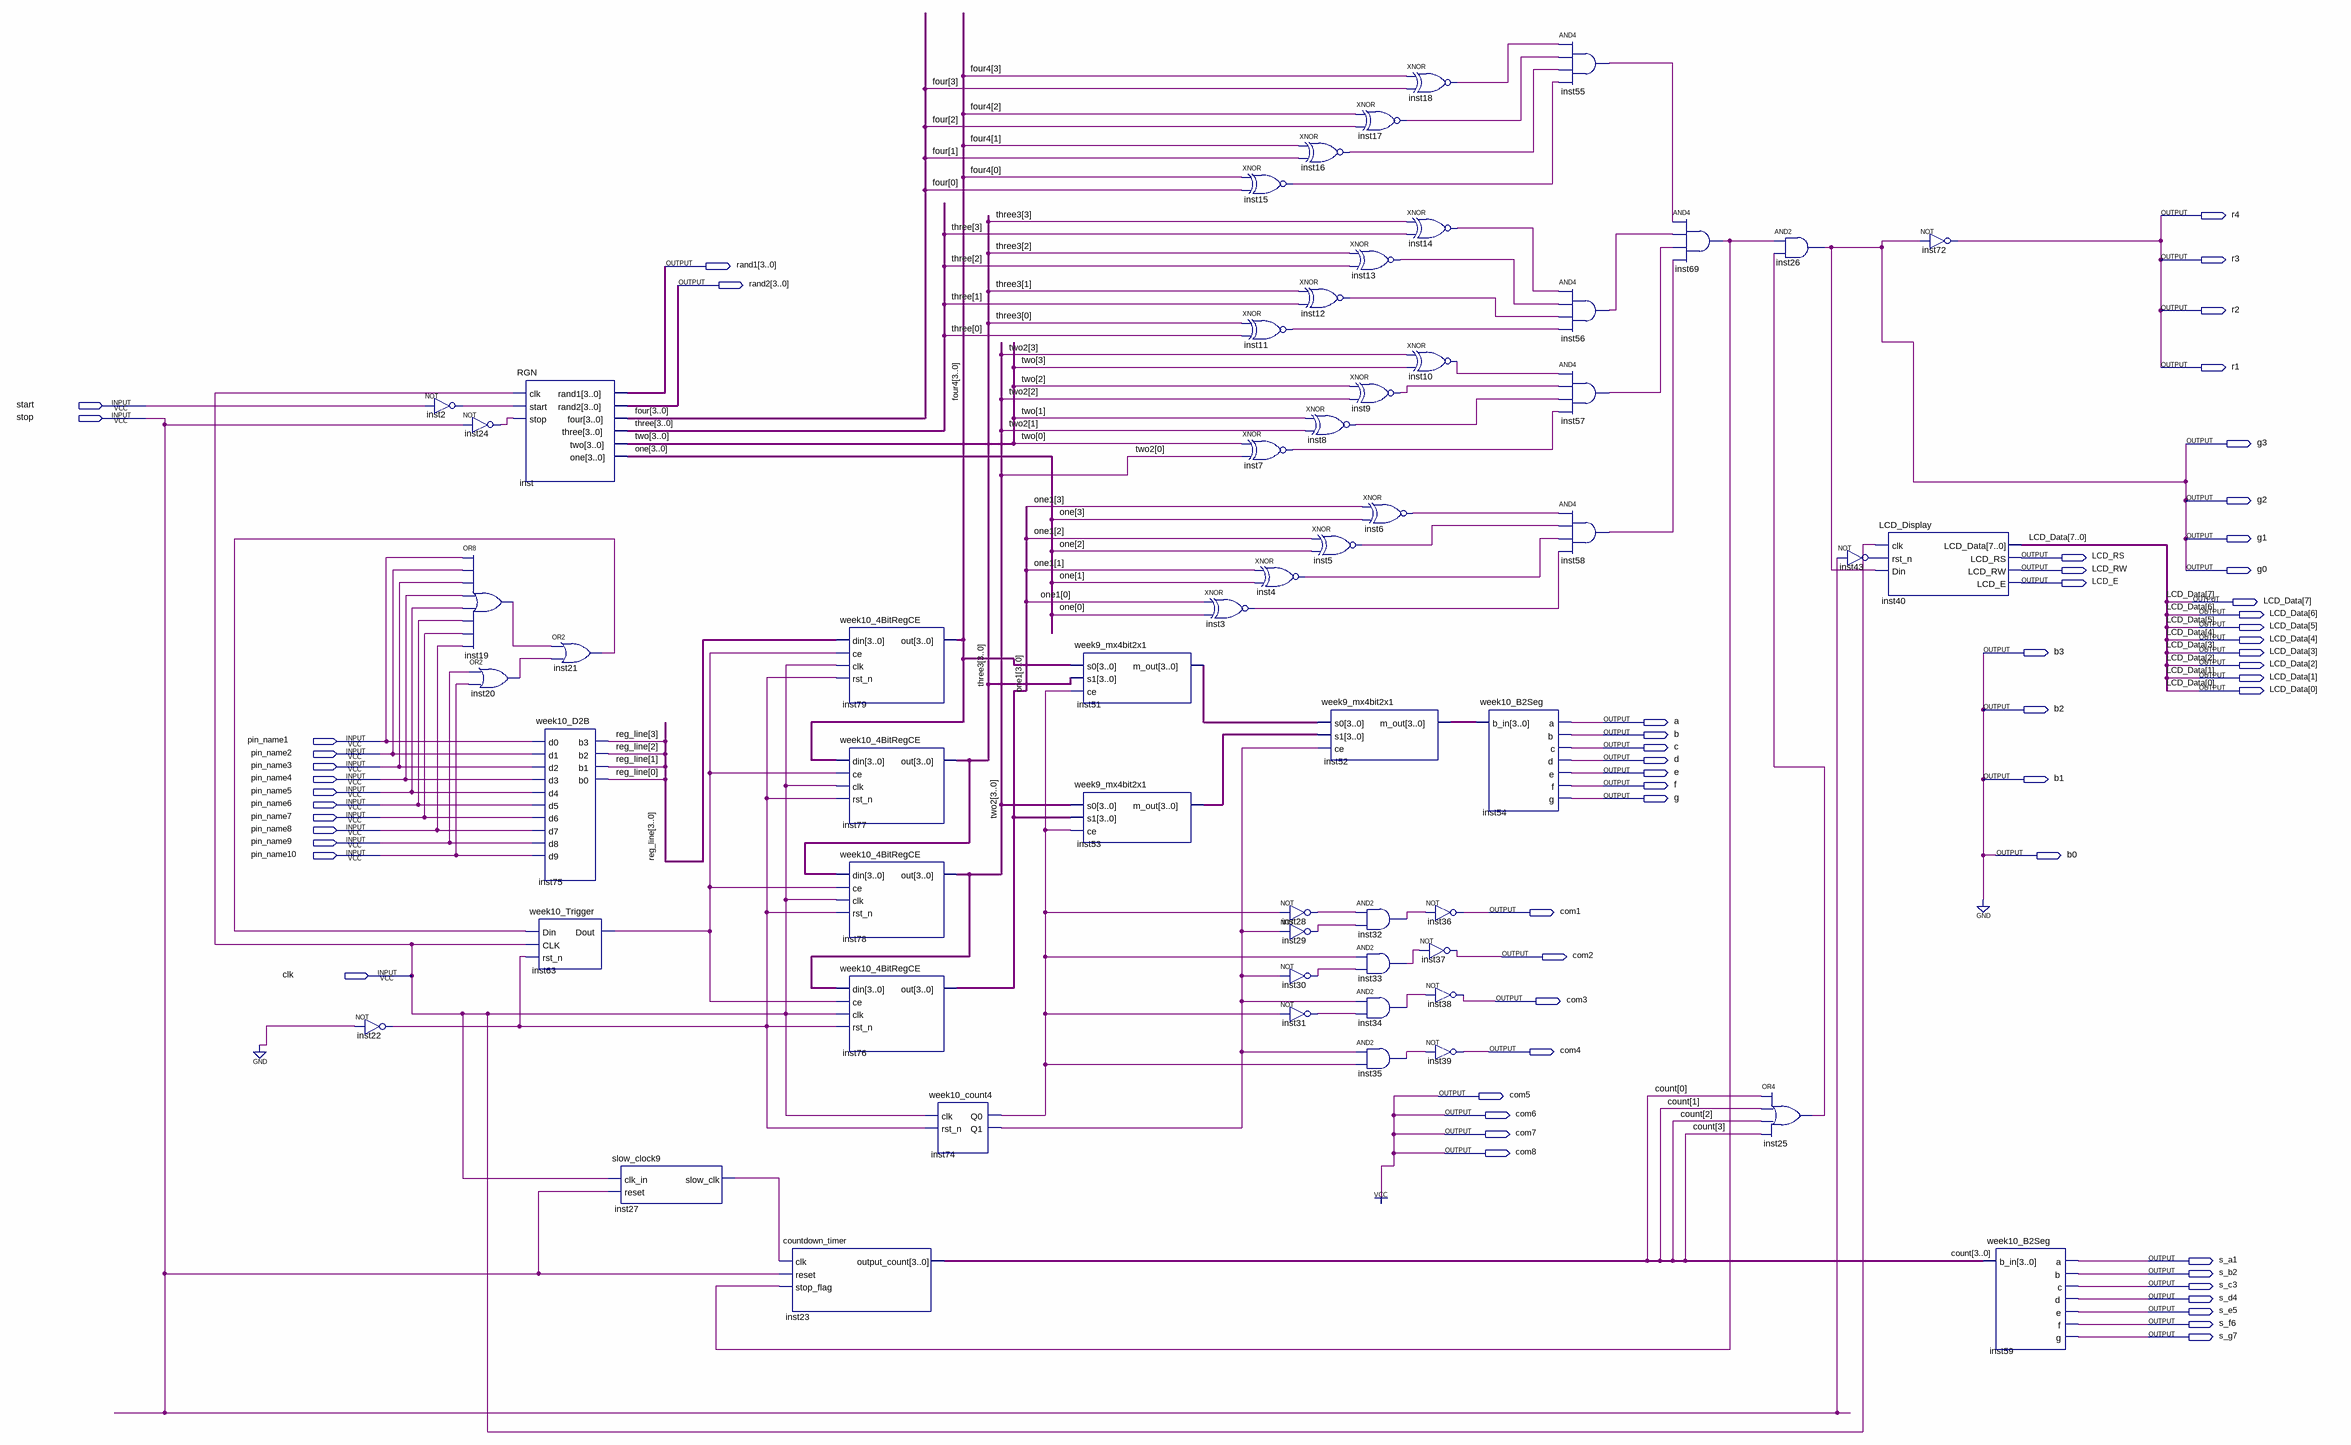
[diagram p0: schematic sheet]
// Quartus schematic FinalModule.bdf as structural Verilog: 59 symbols, 60 pins
module FinalModule (
  input  start,
  input  stop,
  input  pin_name1,
  input  pin_name2,
  input  pin_name3,
  input  pin_name4,
  input  pin_name5,
  input  pin_name6,
  input  pin_name7,
  input  pin_name8,
  input  pin_name9,
  input  pin_name10,
  input  clk,
  output r4,
  output r3,
  output [3:0] rand1,
  output [3:0] rand2,
  output r2,
  output r1,
  output g3,
  output g2,
  output g1,
  output LCD_RS,
  output LCD_RW,
  output g0,
  output LCD_E,
  output [7:0] LCD_Data,
  output b3,
  output b2,
  output a,
  output b,
  output c,
  output d,
  output e,
  output b1,
  output f,
  output g,
  output b0,
  output com1,
  output com2,
  output com3,
  output com4,
  output com5,
  output com6,
  output com7,
  output com8,
  output s_a1,
  output s_b2,
  output s_c3,
  output s_d4,
  output s_e5,
  output s_f6,
  output s_g7
);

  wire inst2_out, inst3_out, inst4_out, inst5_out, inst6_out, inst7_out, inst8_out, inst9_out, inst10_out,
       inst11_out, inst12_out, inst13_out, inst14_out, inst15_out, inst16_out, inst17_out, inst18_out,
       inst19_out, inst20_out, inst21_out, inst22_out, inst24_out, inst25_out, inst27_slow_clk, inst28_out,
       inst29_out, inst30_out, inst31_out, inst32_out, inst33_out, inst34_out, inst35_out, inst43_out,
       inst55_out, inst56_out, inst57_out, inst58_out, inst63_dout, inst69_out, inst74_q0, inst74_q1;
  wire [3:0] count, four, four4, inst51_m_out, inst52_m_out, inst53_m_out, one, one1, reg_line, three,
       three3, two, two2;

  not inst22 (inst22_out, 1'b0);
  not inst2 (inst2_out, start);
  not inst24 (inst24_out, stop);
  or inst19 (inst19_out, pin_name1, pin_name2, pin_name3, pin_name4, pin_name5, pin_name6, pin_name7, pin_name8);
  or inst20 (inst20_out, pin_name9, pin_name10);
  RGN inst (
    .clk(clk), .start(inst2_out), .stop(inst24_out), .rand1(rand1), .rand2(rand2), .four(four),
    .three(three), .two(two), .one(one));
  week10_D2B inst75 (
    .d0(pin_name1), .d1(pin_name2), .d2(pin_name3), .d3(pin_name4), .d4(pin_name5), .d5(pin_name6),
    .d6(pin_name7), .d7(pin_name8), .d8(pin_name9), .d9(pin_name10), .b3(reg_line[3]), .b2(reg_line[2]),
    .b1(reg_line[1]), .b0(reg_line[0]));
  week10_Trigger inst63 (.Din(inst21_out), .CLK(clk), .rst_n(inst22_out), .Dout(inst63_dout));
  or inst21 (inst21_out, inst19_out, inst20_out);
  slow_clock9 inst27 (.clk_in(clk), .reset(stop), .slow_clk(inst27_slow_clk));
  countdown_timer inst23 (.clk(inst27_slow_clk), .reset(stop), .stop_flag(inst69_out), .output_count(count));
  week10_4BitRegCE inst79 (.din(reg_line), .ce(inst63_dout), .clk(clk), .rst_n(inst22_out), .out(four4));
  week10_4BitRegCE inst77 (.din(four4), .ce(inst63_dout), .clk(clk), .rst_n(inst22_out), .out(three3));
  week10_4BitRegCE inst78 (.din(three3), .ce(inst63_dout), .clk(clk), .rst_n(inst22_out), .out(two2));
  week10_4BitRegCE inst76 (.din(two2), .ce(inst63_dout), .clk(clk), .rst_n(inst22_out), .out(one1));
  week10_count4 inst74 (.clk(clk), .rst_n(inst22_out), .Q0(inst74_q0), .Q1(inst74_q1));
  week9_mx4bit2x1 inst51 (.s0(four4), .s1(three3), .ce(inst74_q0), .m_out(inst51_m_out));
  week9_mx4bit2x1 inst53 (.s0(two2), .s1(one1), .ce(inst74_q0), .m_out(inst53_m_out));
  xnor inst15 (inst15_out, four4[0], four[0]);
  xnor inst11 (inst11_out, three3[0], three[0]);
  xnor inst7 (inst7_out, two[0], two2[0]);
  xnor inst3 (inst3_out, one1[0], one[0]);
  xnor inst4 (inst4_out, one1[1], one[1]);
  not inst28 (inst28_out, inst74_q0);
  not inst29 (inst29_out, inst74_q1);
  not inst30 (inst30_out, inst74_q1);
  not inst31 (inst31_out, inst74_q0);
  xnor inst16 (inst16_out, four4[1], four[1]);
  xnor inst12 (inst12_out, three3[1], three[1]);
  xnor inst8 (inst8_out, two[1], two2[1]);
  xnor inst5 (inst5_out, one1[2], one[2]);
  week9_mx4bit2x1 inst52 (.s0(inst51_m_out), .s1(inst53_m_out), .ce(inst74_q1), .m_out(inst52_m_out));
  xnor inst17 (inst17_out, four4[2], four[2]);
  xnor inst13 (inst13_out, three3[2], three[2]);
  xnor inst9 (inst9_out, two[2], two2[2]);
  xnor inst6 (inst6_out, one1[3], one[3]);
  and inst32 (inst32_out, inst28_out, inst29_out);
  and inst33 (inst33_out, inst74_q0, inst30_out);
  and inst34 (inst34_out, inst74_q1, inst31_out);
  and inst35 (inst35_out, inst74_q1, inst74_q0);
  xnor inst18 (inst18_out, four4[3], four[3]);
  xnor inst14 (inst14_out, three3[3], three[3]);
  xnor inst10 (inst10_out, two2[3], two[3]);
  not inst36 (com1, inst32_out);
  not inst37 (com2, inst33_out);
  not inst38 (com3, inst34_out);
  not inst39 (com4, inst35_out);
  week10_B2Seg inst54 (.b_in(inst52_m_out), .a(a), .b(b), .c(c), .d(d), .e(e), .f(f), .g(g));
  and inst55 (inst55_out, inst18_out, inst17_out, inst16_out, inst15_out);
  and inst56 (inst56_out, inst14_out, inst13_out, inst12_out, inst11_out);
  and inst57 (inst57_out, inst10_out, inst9_out, inst8_out, inst7_out);
  and inst58 (inst58_out, inst6_out, inst5_out, inst4_out, inst3_out);
  and inst69 (inst69_out, inst55_out, inst56_out, inst57_out, inst58_out);
  and inst26 (g0, inst69_out, inst25_out);
  or inst25 (inst25_out, count[0], count[1], count[2], count[3]);
  not inst43 (inst43_out, stop);
  LCD_Display inst40 (
    .clk(clk), .rst_n(inst43_out), .Din(g0), .LCD_Data(LCD_Data), .LCD_RS(LCD_RS), .LCD_RW(LCD_RW),
    .LCD_E(LCD_E));
  not inst72 (r1, g0);
  week10_B2Seg inst59 (.b_in(count), .a(s_a1), .b(s_b2), .c(s_c3), .d(s_d4), .e(s_e5), .f(s_f6), .g(s_g7));

  assign b0 = 1'b0;
  assign b1 = 1'b0;
  assign b2 = 1'b0;
  assign b3 = 1'b0;
  assign com5 = 1'b1;
  assign com6 = 1'b1;
  assign com7 = 1'b1;
  assign com8 = 1'b1;
  assign g1 = g0;
  assign g2 = g0;
  assign g3 = g0;
  assign r2 = r1;
  assign r3 = r1;
  assign r4 = r1;
endmodule
